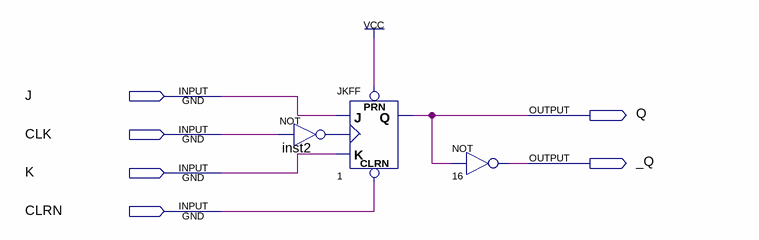
[diagram p0: schematic sheet]
// Quartus schematic 74LS107.bdf as structural Verilog: 3 symbols, 6 pins
module \74LS107  (
  input  J,
  input  CLK,
  input  K,
  input  CLRN,
  output Q,
  output _Q
);

  wire inst2_out;

  JKFF u_1 (.PRN(1'b1), .CLRN(CLRN), .K(K), .J(J), .CLK(inst2_out), .Q(Q));
  not inst2 (inst2_out, CLK);
  not u_16 (_Q, Q);
endmodule
